# Altium schematic sheet Filtro.SchDoc
size A4; SheetNumber: 1; SheetTotal: 1; SPICEModelCacheJJKISZCP: <root> / <DocumentId>JJKISZCP</DocumentId> / <CacheFrame Number="0"> / <Model Name="tl082" Kind="CKT"> / <Text>*TL082 / *Dual WideBW JFETInput OpAmp pkg:DIP8 (A:3,2,8,4,1)(B:5,6,8,4,7) / * Connections: / *             Non-Inverting Input / *             |   Inverting Input / *             |   |   Positive Power Supply / *             |   |   |   Negative Power Supply / *             |   |   |   |   Output / *             |   |   |   |   | / .SUBCKT TL082 1   2   3   4   5 / C1   11 12 3.498E-12 / C2    6  7 15E-12 / DC    5 53 DX / DE   54  5 DX / DLP  90 91 DX / DLN  92 90 DX / DP    4  3 DX / BGND 99  0 V=V(3)*.5 + V(4)*.5 / BB    7 99 I=I(VB)*4.715E6 - I(VC)*5E6 + I(VE)*5E6 + / +              I(VLP)*5E6 - I(VLN)*5E6 / GA    6  0 11 12 282.8E-6 / GCM   0  6 10 99 8.942E-9 / ISS   3 10 DC 195E-6 / HLIM 90  0 VLIM 1K / J1   11  2 10 JX / J2   12  1 10 JX / R2    6  9 100E3 / RD1   4 11 3.536E3 / RD2   4 12 3.536E3 / RO1   8  5 150 / RO2   7 99 150 / RP    3  4 2.143E3 / RSS  10 99 1.026E6 / VB    9  0 DC 0 / VC    3 53 DC 2.2 / VE   54  4 DC 2.2 / VLIM  7  8 DC 0 / VLP  91  0 DC 25 / VLN   0 92 DC 25 / .MODEL DX D(IS=800E-18) / .MODEL JX PJF(IS=15E-12 BETA=270.1E-6 VTO=-1) / .ENDS TL082</Text> / </Model> / </CacheFrame> / </root>
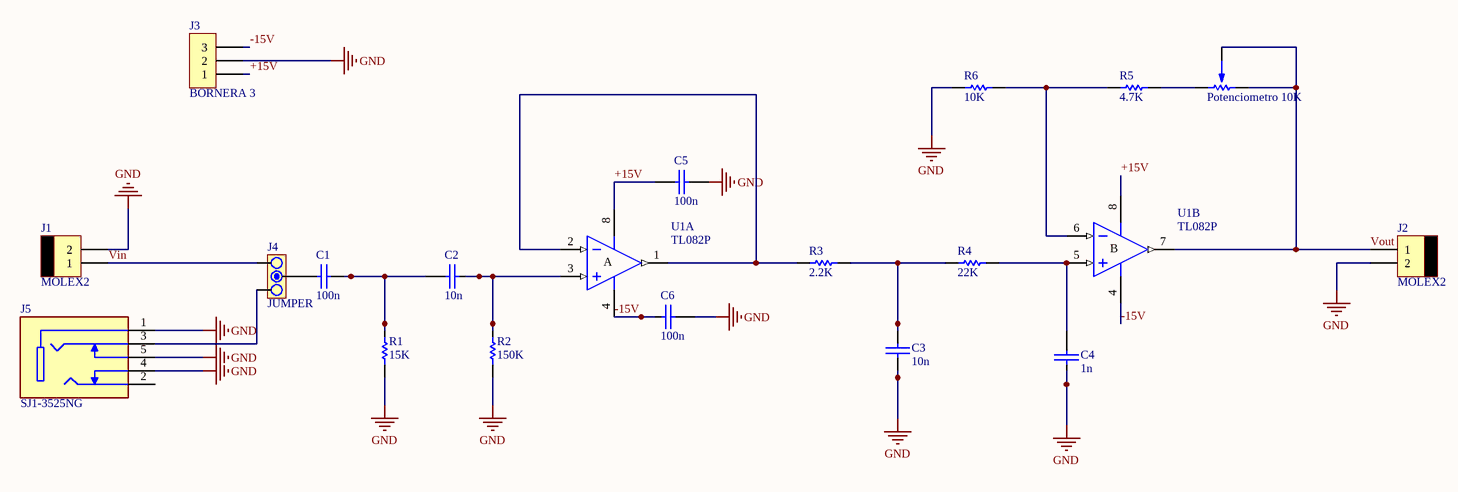
[diagram p0: Filtro.SchDoc]

## Parts
C1  100n  [CAP200]
C2  10n  [CAP200]
C3  10n  [CAP200]
C4  1n  [CAP200]
C5  100n  [CAP200]
C6  100n  [CAP200]
J1  MOLEX2  [MOLEX2]
J2  MOLEX2  [MOLEX2]
J3  BORNERA 3  [BORNERA3]
J4  JUMPER  [JUMPER3TH]
J5  SJ1-3525NG  [CUI_SJ1-3525NG]
Potenciometro_10K  POTENCIOMETRO  [POTENCIOMETRO]  (value not drawn)
R1  15K  [RES400]
R2  150K  [RES400]
R3  2.2K  [RES400]
R4  22K  [RES400]
R5  4.7K  [RES400]
R6  10K  [RES400]
U1  TL082P  [P008]  (parts A,B of 2)

## Nets
GND: C3.2 C4.2 C5.2 C6.2 J1.2 J2.2 J3.2 J5.1 J5.4 J5.5 R1.1 R2.1 R6.1
+15V: C5.1 J3.1 U1.8(V+)
-15V: C6.1 J3.3 U1.4(V-)
Vin: J1.1 J4.3
Vout: J2.1 Potenciometro_10K.2 Potenciometro_10K.3 U1.7(OUT)
NetC1_1: C1.1 J4.2
NetC1_2: C1.2 C2.1 R1.2
NetC2_2: C2.2 R2.2 U1.3(IN+)
NetC3_1: C3.1 R3.2 R4.1
NetC4_1: C4.1 R4.2 U1.5(IN+)
NetJ4_1: J4.1 J5.3
NetPotenciometro_10K_1: Potenciometro_10K.1 R5.2
NetR3_1: R3.1 U1.1(OUT) U1.2(IN-)
NetR5_1: R5.1 R6.2 U1.6(IN-)

Not connected (* = marked no-connect by the designer): J5 2

## Notes on the sheet
- (in symbol TL082P, part A) A
- (in symbol TL082P, part B) B

## Library data of the parts
C1-C6 = CAP
J4 = JUMPER3TH: TIRA DE PINES 1x3
J5 = SJ1-3525NG: 3.5 mm, Stereo, Right Angle, Through Hole, Isolated Ground, 3 Conductors, 2 Internal Switches, Audio Jack Connector; MF: Same Sky; SnapEDA_Link: https://www.snapeda.com/parts/SJ1-3525NG/Same+Sky/view-part/?ref=snap; Package: None; Value: *; MP: SJ1-3525NG; Check_prices: https://www.snapeda.com/parts/SJ1-3525NG/Same+Sky/view-part/?ref=eda
R1-R6 = RES
U1 = TL082P: JFET-Input Operational Amplifier; Published: 16-Jan-2001; LatestRevisionDate: 04-Mar-2005; LatestRevisionNote: Stylized 3D Model Added.; DatasheetVersion: Feb-1999; PackageVersion: Jun-1999; PackageReference: P008; Publisher: Altium Limited; PackageDescription: DIP; 8 Leads; Row Spacing 7.62 mm; Pitch 2.54 mm; Code_JEDEC: MO-001-AN; ComponentLink1Description: Manufacturer Link; ComponentLink1URL: http://www.ti.com/; ComponentLink2Description: Datasheet; ComponentLink2URL: http://www-s.ti.com/sc/ds/tl082.pdf